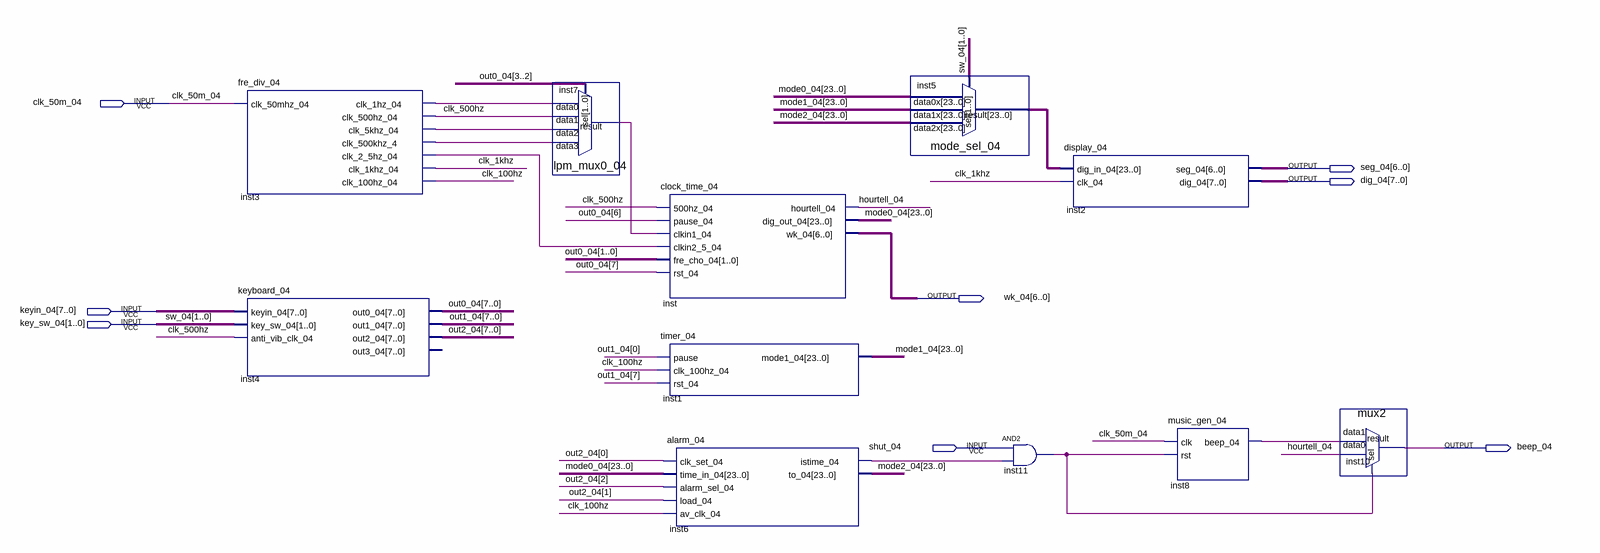
[diagram p0: schematic sheet]
// Quartus schematic dynamic_04.bdf as structural Verilog: 11 symbols, 8 pins
module dynamic_04 (
  input  clk_50m_04,
  input  [7:0] keyin_04,
  input  [1:0] key_sw_04,
  input  shut_04,
  output [6:0] seg_04,
  output [7:0] dig_04,
  output [6:0] wk_04,
  output beep_04
);

  wire clk_1khz, clk_100hz, clk_500hz, hourtell_04, inst3_clk_1hz_04, inst3_clk_2_5hz_04, inst3_clk_5khz_04,
       inst3_clk_500khz_4, inst6_istime_04, inst7_result, inst8_beep_04, inst11_out;
  wire [7:0] out0_04, out1_04, out2_04;
  wire [23:0] inst5_result, mode0_04, mode1_04, mode2_04;

  fre_div_04 inst3 (
    .clk_50mhz_04(clk_50m_04), .clk_1hz_04(inst3_clk_1hz_04), .clk_500hz_04(clk_500hz),
    .clk_5khz_04(inst3_clk_5khz_04), .clk_500khz_4(inst3_clk_500khz_4), .clk_2_5hz_04(inst3_clk_2_5hz_04),
    .clk_1khz_04(clk_1khz), .clk_100hz_04(clk_100hz));
  keyboard_04 inst4 (
    .keyin_04(keyin_04), .key_sw_04(key_sw_04), .anti_vib_clk_04(clk_500hz), .out0_04(out0_04),
    .out1_04(out1_04), .out2_04(out2_04));  // open: out3_04
  lpm_mux0_04 inst7 (
    .data3(inst3_clk_500khz_4), .data2(inst3_clk_5khz_04), .data1(clk_500hz), .data0(inst3_clk_1hz_04),
    .sel(out0_04[3:2]), .result(inst7_result));
  clock_time_04 inst (
    .\500hz_04 (clk_500hz), .pause_04(out0_04[6]), .clkin1_04(inst7_result),
    .clkin2_5_04(inst3_clk_2_5hz_04), .fre_cho_04(out0_04[1:0]), .rst_04(out0_04[7]),
    .hourtell_04(hourtell_04), .dig_out_04(mode0_04), .wk_04(wk_04));
  timer_04 inst1 (.pause(out1_04[0]), .clk_100hz_04(clk_100hz), .rst_04(out1_04[7]), .mode1_04(mode1_04));
  alarm_04 inst6 (
    .clk_set_04(out2_04[0]), .time_in_04(mode0_04), .alarm_sel_04(out2_04[2]), .load_04(out2_04[1]),
    .av_clk_04(clk_100hz), .istime_04(inst6_istime_04), .to_04(mode2_04));
  mode_sel_04 inst5 (.data2x(mode2_04), .data1x(mode1_04), .data0x(mode0_04), .sel(key_sw_04), .result(inst5_result));
  and inst11 (inst11_out, shut_04, inst6_istime_04);
  display_04 inst2 (.dig_in_04(inst5_result), .clk_04(clk_1khz), .seg_04(seg_04), .dig_04(dig_04));
  music_gen_04 inst8 (.clk(clk_50m_04), .rst(inst11_out), .beep_04(inst8_beep_04));
  mux2 inst10 (.data1(inst8_beep_04), .data0(hourtell_04), .sel(inst11_out), .result(beep_04));

  // Other names for the same wires on the sheet: sw_04[1:0] = key_sw_04
endmodule
